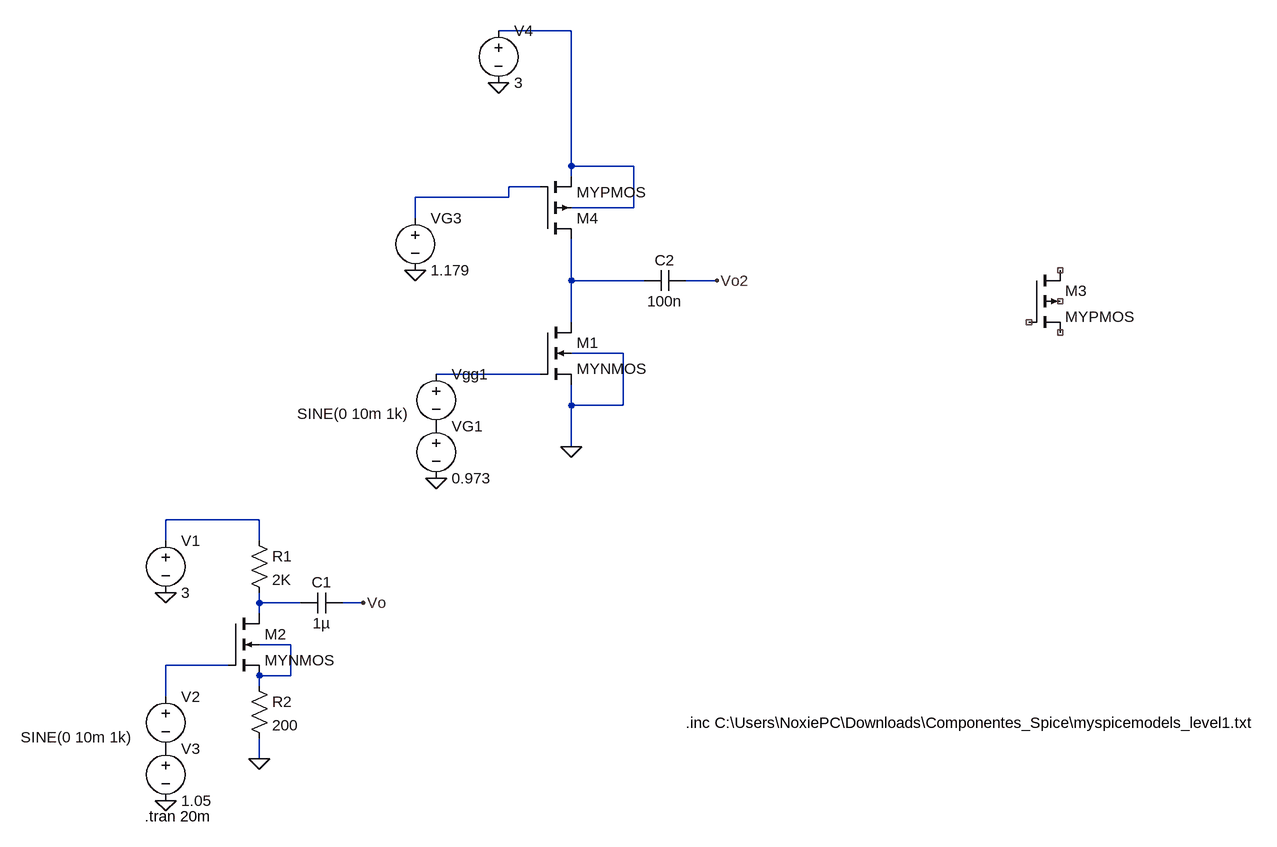
[diagram p0: schematic circuito3_20_&_24.asc]
circuito3_20_&_24.asc, the LTspice schematic file:
Version 4.1
SHEET 1 1764 680
WIRE 624 -880 512 -880
WIRE 624 -672 624 -880
WIRE 720 -672 624 -672
WIRE 624 -656 624 -672
WIRE 576 -640 528 -640
WIRE 528 -624 528 -640
WIRE 528 -624 384 -624
WIRE 720 -608 720 -672
WIRE 720 -608 624 -608
WIRE 384 -592 384 -624
WIRE 624 -496 624 -560
WIRE 736 -496 624 -496
WIRE 848 -496 800 -496
WIRE 624 -432 624 -496
WIRE 704 -384 624 -384
WIRE 576 -352 416 -352
WIRE 624 -304 624 -336
WIRE 704 -304 704 -384
WIRE 704 -304 624 -304
WIRE 624 -240 624 -304
WIRE 144 -128 0 -128
WIRE 0 -96 0 -128
WIRE 144 -96 144 -128
WIRE 144 0 144 -16
WIRE 208 0 144 0
WIRE 304 0 272 0
WIRE 144 16 144 0
WIRE 192 64 144 64
WIRE 96 96 0 96
WIRE 192 112 192 64
WIRE 192 112 144 112
WIRE 144 128 144 112
WIRE 0 144 0 96
WIRE 144 240 144 208
FLAG 144 240 0
FLAG 0 304 0
FLAG 0 -16 0
FLAG 304 0 Vo
FLAG 512 -800 0
FLAG 848 -496 Vo2
FLAG 624 -240 0
FLAG 416 -192 0
FLAG 384 -512 0
SYMBOL voltage 0 -112 R0
WINDOW 123 0 0 Left 0
WINDOW 39 0 0 Left 0
SYMATTR InstName V1
SYMATTR Value 3
SYMBOL res 128 -112 R0
SYMATTR InstName R1
SYMATTR Value 2K
SYMBOL cap 272 -16 R90
WINDOW 0 0 32 VBottom 2
WINDOW 3 32 32 VTop 2
SYMATTR InstName C1
SYMATTR Value 1µ
SYMBOL voltage 0 128 R0
WINDOW 123 0 0 Left 0
WINDOW 39 0 0 Left 0
WINDOW 3 -223 79 Left 2
SYMATTR Value SINE(0 10m 1k)
SYMATTR InstName V2
SYMBOL voltage 0 208 R0
WINDOW 123 0 0 Left 0
WINDOW 39 0 0 Left 0
SYMATTR InstName V3
SYMATTR Value 1.05
SYMBOL res 128 112 R0
SYMATTR InstName R2
SYMATTR Value 200
SYMBOL nmos4 576 -432 R0
SYMATTR InstName M1
SYMATTR Value MYNMOS
SYMATTR Value2 l=0.5u w=50u
SYMBOL nmos4 96 16 R0
SYMATTR InstName M2
SYMATTR Value MYNMOS
SYMATTR Value2 l=.5u w=50u
SYMBOL pmos4 1328 -512 R0
SYMATTR InstName M3
SYMATTR Value MYPMOS
SYMATTR Value2 l=2u w=50u
SYMBOL voltage 512 -896 R0
WINDOW 123 0 0 Left 0
WINDOW 39 0 0 Left 0
SYMATTR InstName V4
SYMATTR Value 3
SYMBOL voltage 416 -368 R0
WINDOW 123 0 0 Left 0
WINDOW 39 0 0 Left 0
WINDOW 3 -214 77 Left 2
SYMATTR Value SINE(0 10m 1k)
SYMATTR InstName Vgg1
SYMBOL voltage 416 -288 R0
WINDOW 123 0 0 Left 0
WINDOW 39 0 0 Left 0
SYMATTR InstName VG1
SYMATTR Value 0.973
SYMBOL voltage 384 -608 R0
WINDOW 123 0 0 Left 0
WINDOW 39 0 0 Left 0
SYMATTR InstName VG3
SYMATTR Value 1.179
SYMBOL pmos4 576 -560 M180
SYMATTR InstName M4
SYMATTR Value MYPMOS
SYMATTR Value2 l=2u w=50u
SYMBOL cap 800 -512 R90
WINDOW 0 0 32 VBottom 2
WINDOW 3 32 32 VTop 2
SYMATTR InstName C2
SYMATTR Value 100n
TEXT 800 184 Left 2 !.inc C:\\Users\\NoxiePC\\Downloads\\Componentes_Spice\\myspicemodels_level1.txt
TEXT -32 328 Left 2 !.tran 20m

The netlist it stands for:
* circuito3_20_&_24.asc
V1 N005 0 3
R1 N005 N006 2K
C1 Vo N006 1µ
V2 N008 P001 SINE(0 10m 1k)
V3 P001 0 1.05
R2 N007 0 200
M1 N003 N004 0 0 MYNMOS l=0.5u w=50u
M2 N006 N008 N007 N007 MYNMOS l=.5u w=50u
M3 NC_01 NC_02 NC_03 NC_04 MYPMOS l=2u w=50u
V4 N001 0 3
Vgg1 N004 P002 SINE(0 10m 1k)
VG1 P002 0 0.973
VG3 N002 0 1.179
M4 N003 N002 N001 N001 MYPMOS l=2u w=50u
C2 Vo2 N003 100n
.model NMOS NMOS
.model PMOS PMOS
.lib standard.mos
.inc C:\Users\NoxiePC\Downloads\Componentes_Spice\myspicemodels_level1.txt
.tran 20m
.backanno
.end